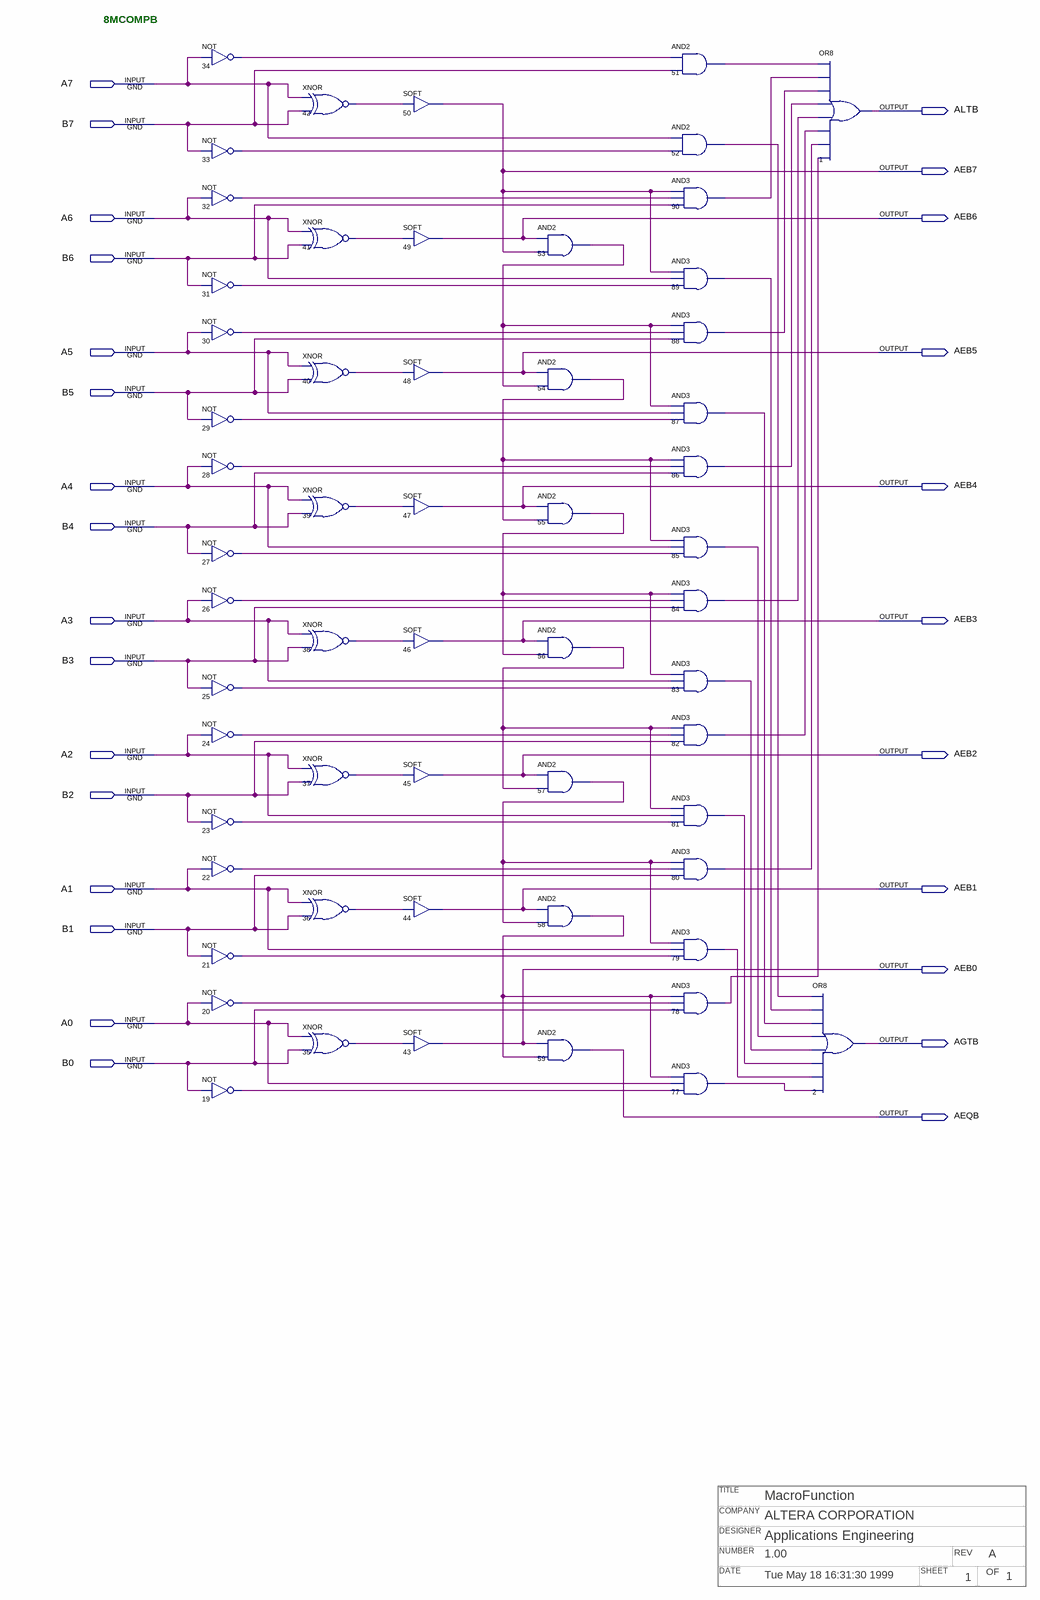
[diagram p0: schematic sheet]
// Quartus schematic p8mcompb.bdf as structural Verilog: 57 symbols, 27 pins
// Title block: TITLE: MacroFunction; COMPANY: ALTERA CORPORATION; DESIGNER: Applications Engineering; NUMBER: 1.00; REV: A; DATE: Tue May 18 16:31:30 1999; SHEET: 1; OF: 1
module p8mcompb (
  input  A7,
  input  B7,
  input  A6,
  input  B6,
  input  A5,
  input  B5,
  input  A4,
  input  B4,
  input  A3,
  input  B3,
  input  A2,
  input  B2,
  input  A1,
  input  B1,
  input  A0,
  input  B0,
  output ALTB,
  output AEB7,
  output AEB6,
  output AEB5,
  output AEB4,
  output AEB3,
  output AEB2,
  output AEB1,
  output AEB0,
  output AGTB,
  output AEQB
);

  wire n19_out, n20_out, n21_out, n22_out, n23_out, n24_out, n25_out, n26_out, n27_out, n28_out, n29_out,
       n30_out, n31_out, n32_out, n33_out, n34_out, n35_out, n36_out, n37_out, n38_out, n39_out, n40_out,
       n41_out, n42_out, n51_out, n52_out, n53_out, n54_out, n55_out, n56_out, n57_out, n58_out, n77_out,
       n78_out, n79_out, n80_out, n81_out, n82_out, n83_out, n84_out, n85_out, n86_out, n87_out, n88_out,
       n89_out, n90_out;

  not u_34 (n34_out, A7);
  not u_33 (n33_out, B7);
  not u_32 (n32_out, A6);
  not u_31 (n31_out, B6);
  not u_30 (n30_out, A5);
  not u_29 (n29_out, B5);
  not u_28 (n28_out, A4);
  not u_27 (n27_out, B4);
  not u_26 (n26_out, A3);
  not u_25 (n25_out, B3);
  not u_24 (n24_out, A2);
  not u_23 (n23_out, B2);
  not u_22 (n22_out, A1);
  not u_21 (n21_out, B1);
  not u_20 (n20_out, A0);
  not u_19 (n19_out, B0);
  xnor u_42 (n42_out, A7, B7);
  xnor u_41 (n41_out, A6, B6);
  xnor u_40 (n40_out, A5, B5);
  xnor u_39 (n39_out, A4, B4);
  xnor u_38 (n38_out, A3, B3);
  xnor u_37 (n37_out, A2, B2);
  xnor u_36 (n36_out, A1, B1);
  xnor u_35 (n35_out, A0, B0);
  SOFT u_50 (.IN(n42_out), .OUT(AEB7));
  SOFT u_49 (.IN(n41_out), .OUT(AEB6));
  SOFT u_48 (.IN(n40_out), .OUT(AEB5));
  SOFT u_47 (.IN(n39_out), .OUT(AEB4));
  SOFT u_46 (.IN(n38_out), .OUT(AEB3));
  SOFT u_45 (.IN(n37_out), .OUT(AEB2));
  SOFT u_44 (.IN(n36_out), .OUT(AEB1));
  SOFT u_43 (.IN(n35_out), .OUT(AEB0));
  and u_53 (n53_out, AEB6, AEB7);
  and u_54 (n54_out, AEB5, n53_out);
  and u_55 (n55_out, AEB4, n54_out);
  and u_56 (n56_out, AEB3, n55_out);
  and u_57 (n57_out, AEB2, n56_out);
  and u_58 (n58_out, AEB1, n57_out);
  and u_59 (AEQB, AEB0, n58_out);
  and u_51 (n51_out, n34_out, B7);
  and u_52 (n52_out, A7, n33_out);
  and u_90 (n90_out, AEB7, n32_out, B6);
  and u_89 (n89_out, AEB7, A6, n31_out);
  and u_88 (n88_out, n53_out, n30_out, B5);
  and u_87 (n87_out, n53_out, A5, n29_out);
  and u_86 (n86_out, n54_out, n28_out, B4);
  and u_85 (n85_out, n54_out, A4, n27_out);
  and u_84 (n84_out, n55_out, n26_out, B3);
  and u_83 (n83_out, n55_out, A3, n25_out);
  and u_82 (n82_out, n56_out, n24_out, B2);
  and u_81 (n81_out, n56_out, A2, n23_out);
  and u_80 (n80_out, n57_out, n22_out, B1);
  and u_79 (n79_out, n57_out, A1, n21_out);
  and u_78 (n78_out, n58_out, n20_out, B0);
  and u_77 (n77_out, n58_out, A0, n19_out);
  or u_1 (ALTB, n51_out, n90_out, n88_out, n86_out, n84_out, n82_out, n80_out, n78_out);
  or u_2 (AGTB, n52_out, n89_out, n87_out, n85_out, n83_out, n81_out, n79_out, n77_out);

  // Notes on the sheet:
  //   8MCOMPB
endmodule
